# Altium schematic sheet 基站转接板原理图.SchDoc
size A4
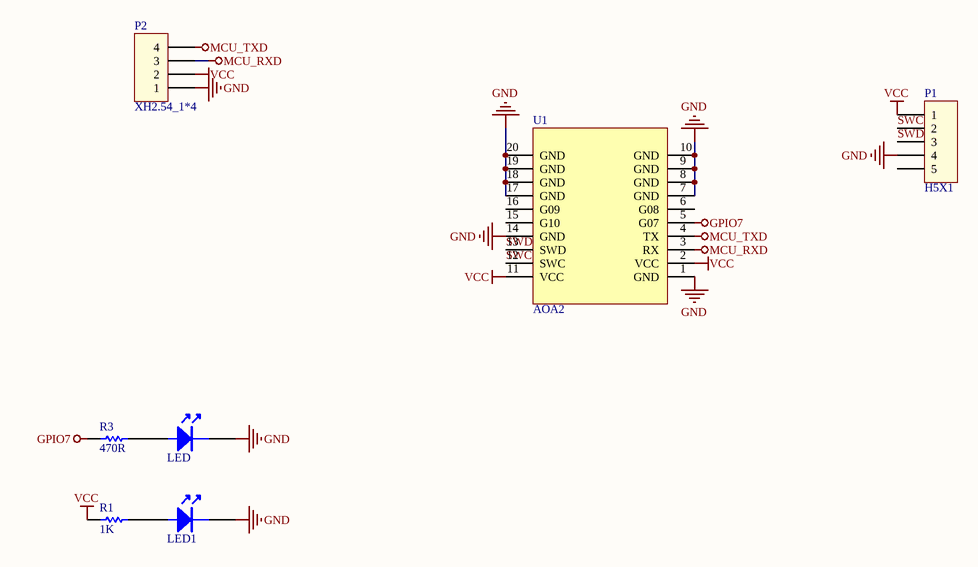
[diagram p0: 基站转接板原理图.SchDoc]

## Parts
LED  LED  [LED_0603]  (value not drawn)
LED1  LED  [LED_0603]  (value not drawn)
P1  H5X1  [H1.27-1X5]
P2  XH2.54_1*4  [XH2.54-LI-4P]
R1  1K  [ALX_0603A]
R3  470R  [ALX_0603A]
U1  AOA2  [4ANTA]

## Nets
GND: LED.2 LED1.2 P1.4 P2.1 U1.1(GND) U1.7(GND) U1.8(GND) U1.9(GND) U1.10(GND) U1.14(GND) U1.17(GND) U1.18(GND) U1.19(GND) U1.20(GND)
GPIO7: R3.1 U1.5(G07)
MCU_RXD: P2.3 U1.3(RX)
MCU_TXD: P2.4 U1.4(TX)
VCC: P1.1 P2.2 R1.1 U1.2(VCC) U1.11(VCC)
SWC: P1.2 U1.12(SWC)
SWD: P1.3 U1.13(SWD)
NetLED1_1: LED1.1 R1.2
NetLED_1: LED.1 R3.2

Not connected (* = marked no-connect by the designer): P1 5; U1 6(G08) 15(G10) 16(G09)

## Library data of the parts
LED LED1 = ALX_LED
R1 R3 = ALX_RES